# Altium schematic sheet FlightControllerBoard.SchDoc
size A
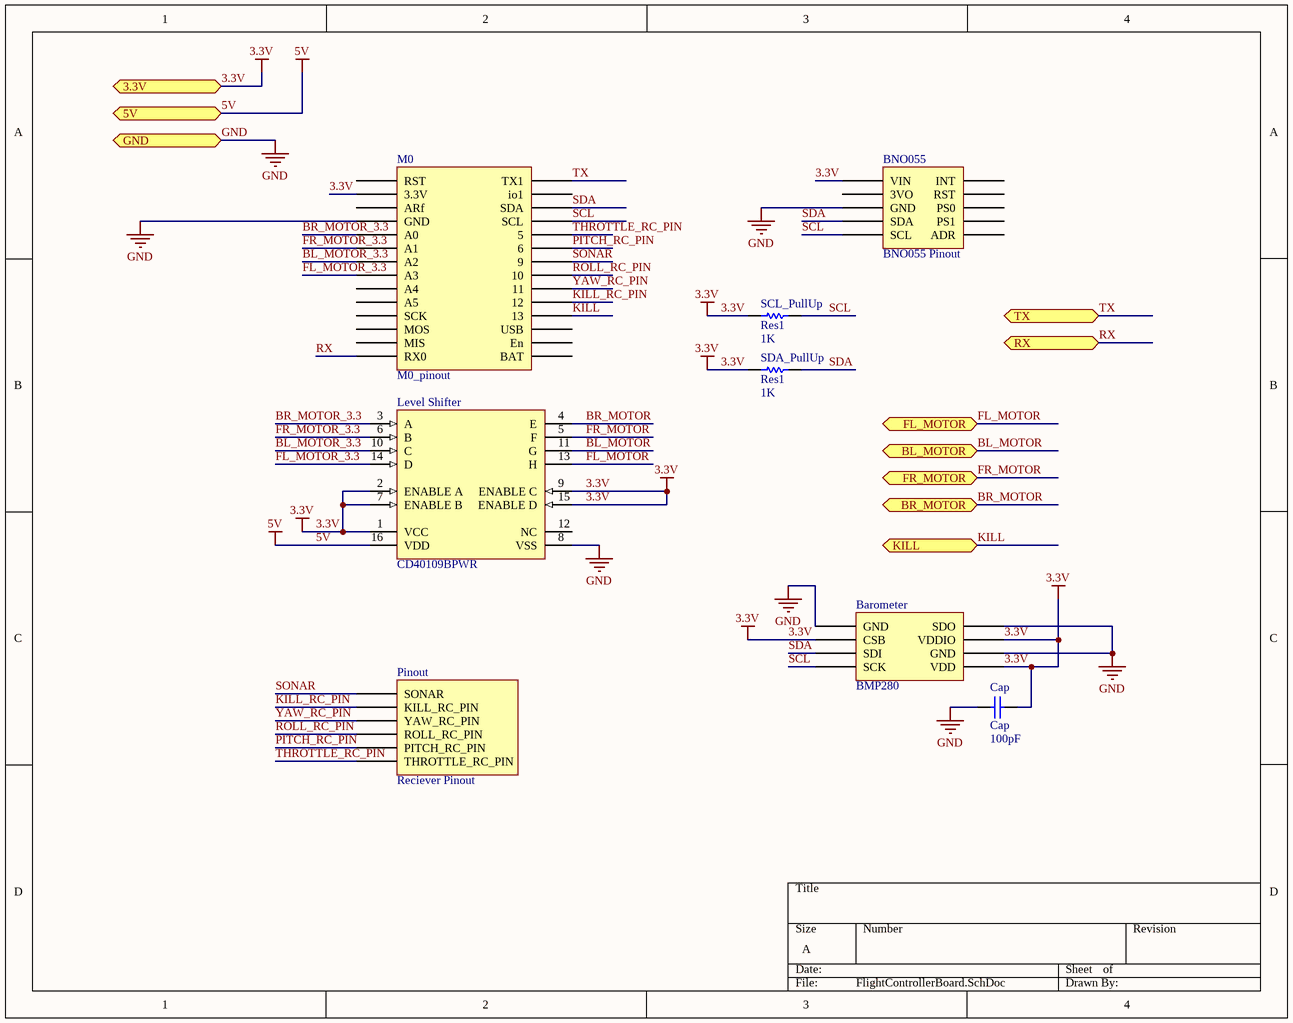
[diagram p0: FlightControllerBoard.SchDoc]

## Parts
Barometer  BMP280  [BMP280]
BNO055  BNO055 Pinout  [BNO055]
Cap  Cap  value 100pF  [RAD-0.3]
Level_Shifter  CD40109BPWR  [PW0016A_N]
M0  M0_pinout  [M0]
Pinout  Reciever Pinout  [Reciever]
SCL_PullUp  Res1  value 1K  [AXIAL-0.3]
SDA_PullUp  Res1  value 1K  [AXIAL-0.3]

## Ports
3.3V, 5V, BL_MOTOR, BR_MOTOR, FL_MOTOR, FR_MOTOR, GND, KILL, RX, TX

## Nets
3.3V: Barometer.CSB Barometer.VDD Barometer.VDDIO BNO055.VIN Cap.2 Level_Shifter.1(VCC) Level_Shifter.2(ENABLE_A) Level_Shifter.7(ENABLE_B) Level_Shifter.9(ENABLE_C) Level_Shifter.15(ENABLE_D) M0.3.3V SCL_PullUp.1 SDA_PullUp.1 ; port 3.3V
5V: Level_Shifter.16(VDD) ; port 5V
GND: Barometer.GND Barometer.SDO BNO055.GND Cap.1 Level_Shifter.8(VSS) M0.GND ; port GND
BL_MOTOR: Level_Shifter.11(G) ; port BL_MOTOR
BL_MOTOR_3.3: Level_Shifter.10(C) M0.A2
BR_MOTOR: Level_Shifter.4(E) ; port BR_MOTOR
BR_MOTOR_3.3: Level_Shifter.3(A) M0.A0
FL_MOTOR: Level_Shifter.13(H) ; port FL_MOTOR
FL_MOTOR_3.3: Level_Shifter.14(D) M0.A3
FR_MOTOR: Level_Shifter.5(F) ; port FR_MOTOR
FR_MOTOR_3.3: Level_Shifter.6(B) M0.A1
KILL: M0.13 ; port KILL
KILL_RC_PIN: M0.12 Pinout.KILL_RC_PIN
PITCH_RC_PIN: M0.6 Pinout.PITCH_RC_PIN
ROLL_RC_PIN: M0.10 Pinout.ROLL_RC_PIN
RX: M0.RX0 ; port RX
SCL: Barometer.SCK BNO055.SCL M0.SCL SCL_PullUp.2
SDA: Barometer.SDI BNO055.SDA M0.SDA SDA_PullUp.2
SONAR: M0.9 Pinout.SONAR
THROTTLE_RC_PIN: M0.5 Pinout.THROTTLE_RC_PIN
TX: M0.TX1 ; port TX
YAW_RC_PIN: M0.11 Pinout.YAW_RC_PIN

Not connected (* = marked no-connect by the designer): BNO055 3VO ADR INT PS0 PS1 RST; Level_Shifter 12(NC); M0 A4 A5 ARf BAT En io1 MIS MOS RST SCK USB

## Library data of the parts
Cap = Cap: Capacitor; Published: 8-Jun-2000; LatestRevisionDate: 17-Jul-2002; LatestRevisionNote: Re-released for DXP Platform.; PackageReference: RAD-0.3; Publisher: Altium Limited; PackageDescription: Radial Cap, Thru-Hole; 2 Leads; 0.3 in Pin Spacing
Level_Shifter = CMP-1527-00009-2: CMOS Quad Low-to-High Voltage Level Shifter, 3 to 18 V, -55 to 125 degC, 16-Pin TSSOP (PW16), RoHS, Tape and Reel; Manufacturer: Texas Instruments; VSS: 3 to 18 V; Number of Bits: 4; Propagation Delay: 240 ns Max.; ComponentLink1Description: Manufacturer URL; ComponentLink3Description: Package Specification; ComponentLink3URL: http://www.ti.com/lit/ml/mpds361/mpds361.pdf; PackageDescription: 16-Pin Plastic Small Outline Package, Body 5 x 4.4 mm, Pitch 0.65 mm; DatasheetVersion: SCHS099B; Temperature Range: -55 to 125 degC; Mounting Technology: Surface Mount; Packing: Tape and Reel; RoHS: TRUE; PartNumber: CD40109BPWR; ComponentLink2Description: Datasheet; Number of Outputs: 4; ComponentLink1URL: www.ti.com; Number of Channels: 4; Package Reference: PW0016A; PackageVersion: 4040064-4/G; ComponentLink2URL: http://www.ti.com/lit/ds/symlink/cd40109b.pdf
Pinout = Reciever Pinout: pin to pad: KILL_RC_PIN>KILL PITCH_RC_PIN>PITCH ROLL_RC_PIN>ROLL THROTTLE_RC_PIN>THR YAW_RC_PIN>YAW
SCL_PullUp SDA_PullUp = Res1: Resistor; Published: 8-Jun-2000; LatestRevisionDate: 17-Jul-2002; LatestRevisionNote: Re-released for DXP Platform.; PackageReference: AXIAL-0.3; Publisher: Altium Limited; PackageDescription: Axial Device, Thru-Hole; 2 Leads; 0.3 in Pin Spacing